# Altium schematic sheet BBB Headers.SchDoc: BBB Headers
size Tabloid; DocumentNumber: LM-003; Revision: C; SheetNumber: 1; SheetTotal: 4
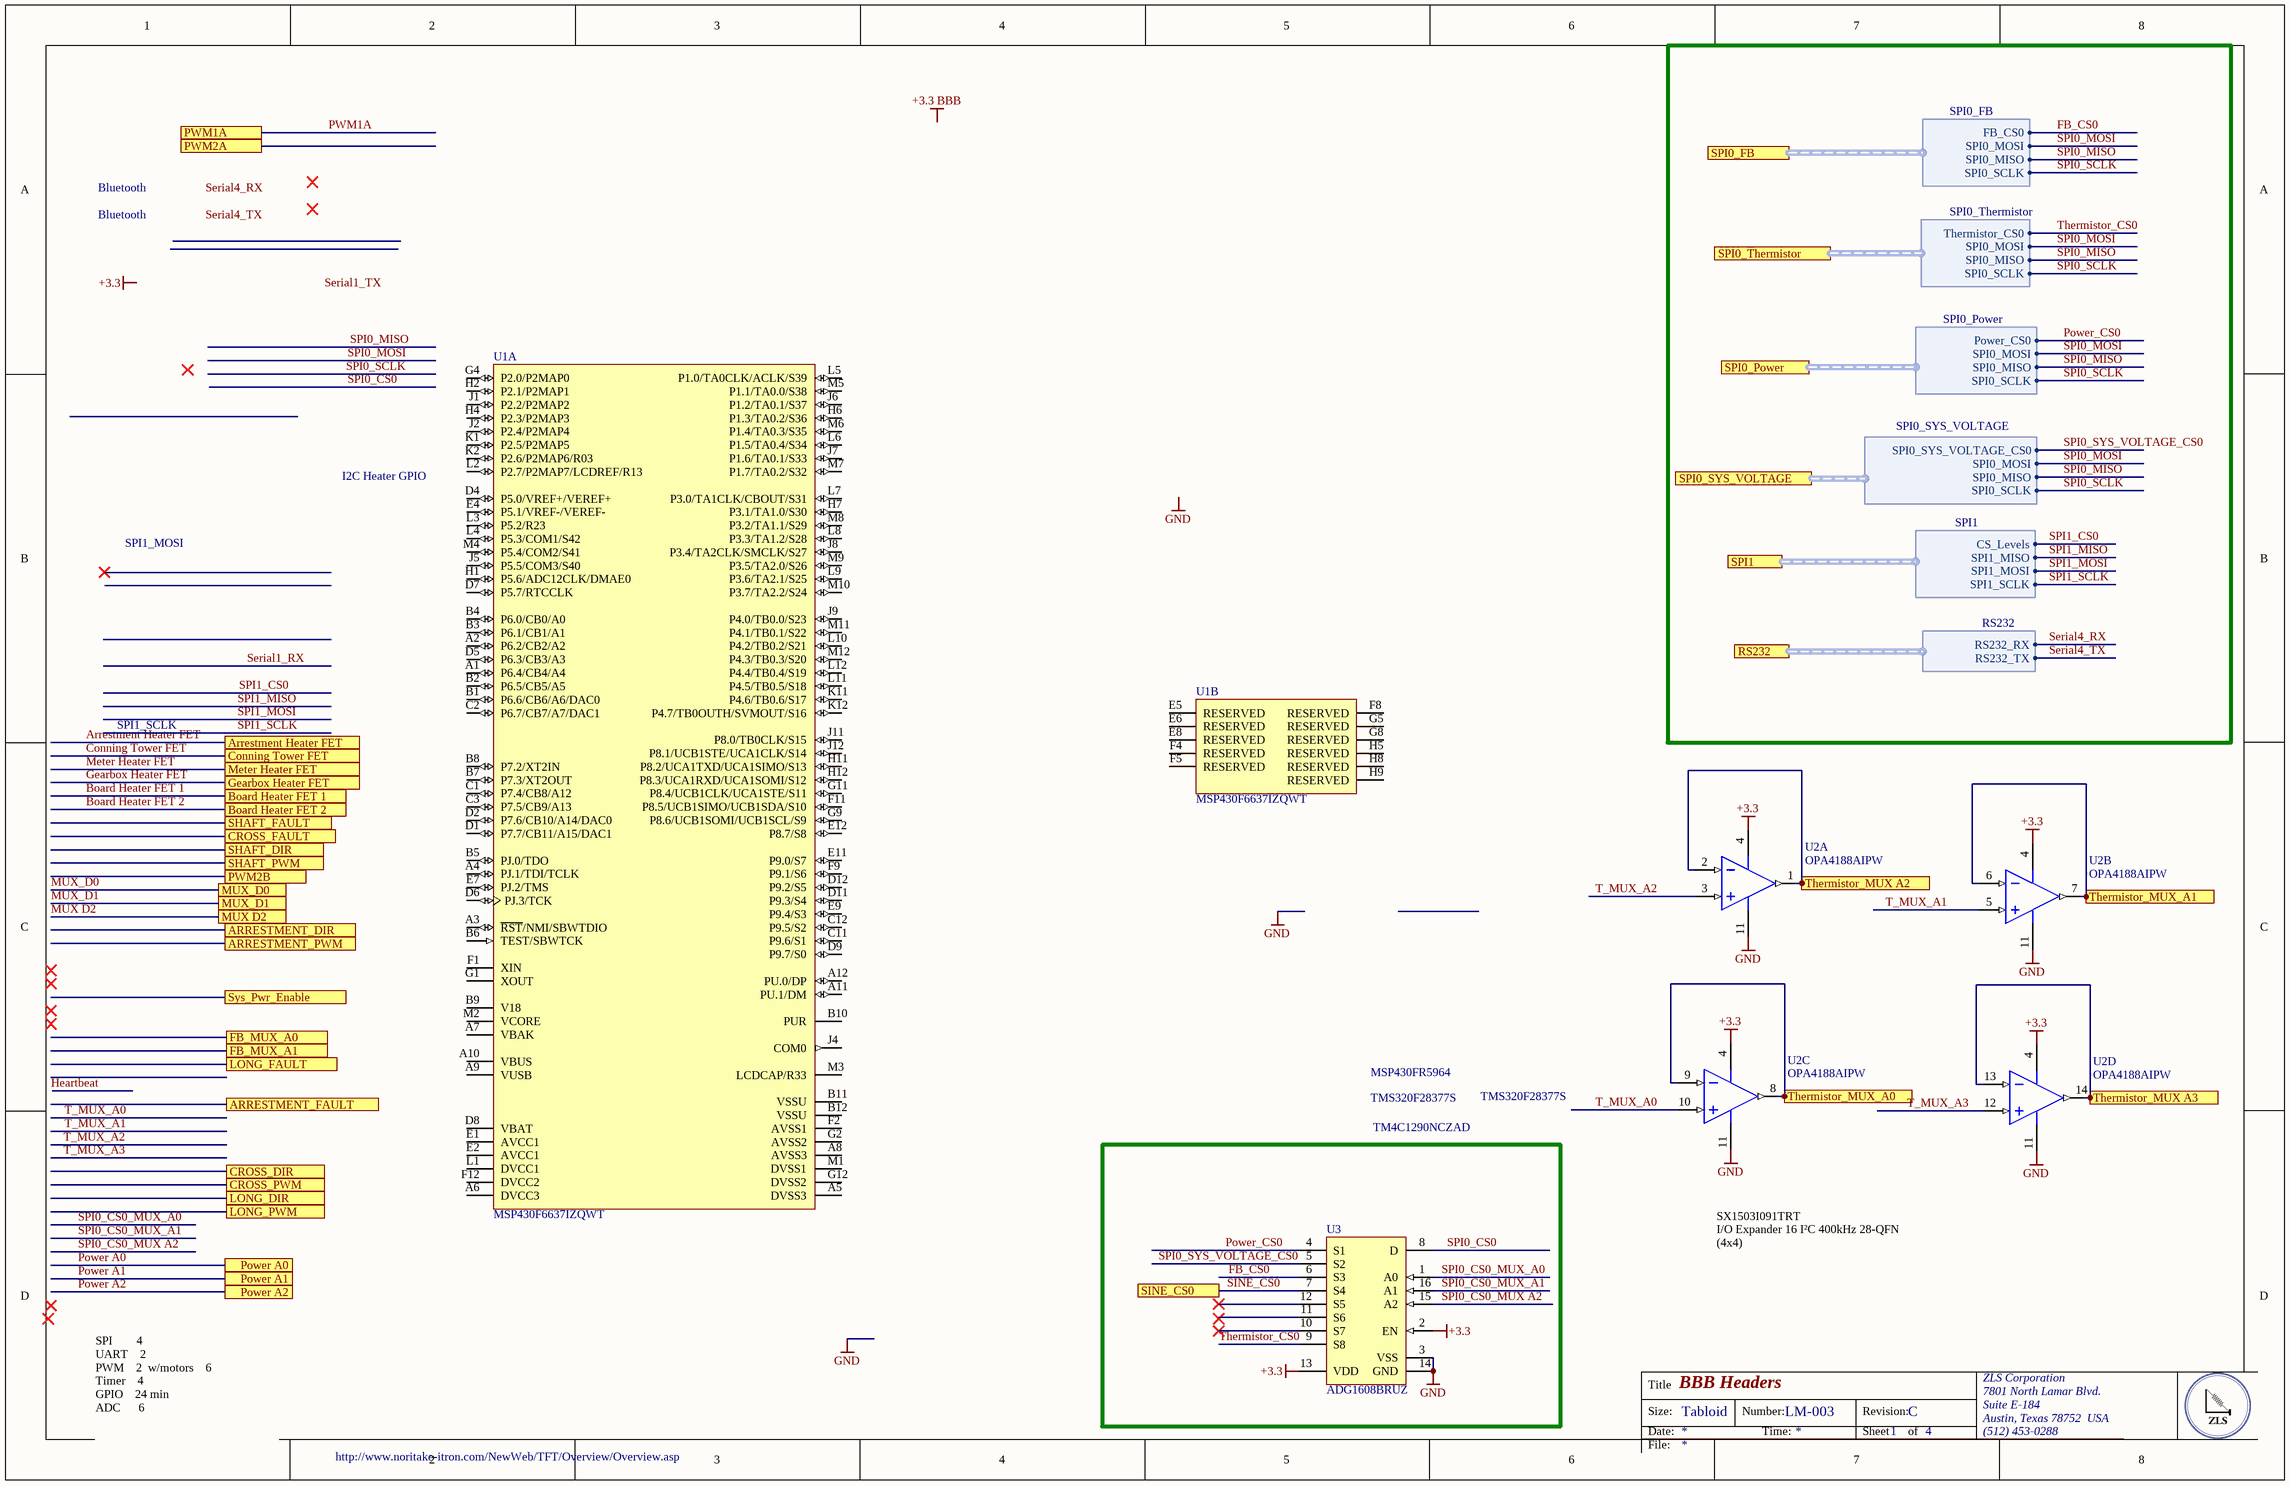
[diagram p0: BBB Headers.SchDoc]

## Parts
U1  MSP430F6637IZQWT  [TI-ZQW113]  (parts A,B of 2)
U2  OPA4188AIPW  [PW0014A_N]  (parts A,B,C,D of 4)
U3  ADG1608BRUZ  [ADI-RU-16_M]

## Blocks framed on the sheet
TM4C1290NCZAD: U3

## Ports
Arrestment Heater FET, ARRESTMENT_DIR, ARRESTMENT_FAULT, ARRESTMENT_PWM, Board Heater FET 1, Board Heater FET 2, Conning Tower FET, CROSS_DIR, CROSS_FAULT, CROSS_PWM, FB_MUX_A0, FB_MUX_A1, Gearbox Heater FET, LONG_DIR, LONG_FAULT, LONG_PWM, Meter Heater FET, MUX D2, MUX_D0, MUX_D1, Power A0, Power A1, Power A2, PWM1A, PWM2A, PWM2B, RS232 (harness RS232), SHAFT_DIR, SHAFT_FAULT, SHAFT_PWM, SINE_CS0, SPI0_FB (harness SPI0_FB), SPI0_Power (harness SPI0_Power), SPI0_SYS_VOLTAGE (harness SPI0_SYS_VOLTAGE), SPI0_Thermistor (harness SPI0_Thermistor), SPI1 (harness SPI1), Sys_Pwr_Enable, Thermistor_MUX A2, Thermistor_MUX A3, Thermistor_MUX_A0, Thermistor_MUX_A1

## Harnesses
RS232: RS232_RX, RS232_TX
SPI1: CS_Levels, SPI1_MISO, SPI1_MOSI, SPI1_SCLK
SPI0_Power: Power_CS0, SPI0_MOSI, SPI0_MISO, SPI0_SCLK
SPI0_Thermistor: Thermistor_CS0, SPI0_MOSI, SPI0_MISO, SPI0_SCLK
SPI0_FB: FB_CS0, SPI0_MOSI, SPI0_MISO, SPI0_SCLK
SPI0_SYS_VOLTAGE: SPI0_SYS_VOLTAGE_CS0, SPI0_MOSI, SPI0_MISO, SPI0_SCLK

## Nets
+3.3: U2.4(V+) U3.2(EN) U3.13(VDD)
GND: U2.11(V-) U3.3(VSS) U3.14(GND)
Arrestment Heater FET: port Arrestment Heater FET
Board Heater FET 1: port Board Heater FET 1
Board Heater FET 2: port Board Heater FET 2
Conning Tower FET: port Conning Tower FET
FB_CS0: U3.6(S3) ; port SPI0_FB.FB_CS0
Gearbox Heater FET: port Gearbox Heater FET
Meter Heater FET: port Meter Heater FET
MUX D2: port MUX D2
MUX_D0: port MUX_D0
MUX_D1: port MUX_D1
Power A0: port Power A0
Power A1: port Power A1
Power A2: port Power A2
Power_CS0: U3.4(S1) ; port SPI0_Power.Power_CS0
PWM1A: port PWM1A
Serial4_RX: port RS232.RS232_RX
Serial4_TX: port RS232.RS232_TX
SINE_CS0: U3.7(S4) ; port SINE_CS0
SPI0_CS0: U3.8(D)
SPI0_CS0_MUX A2: U3.15(A2)
SPI0_CS0_MUX_A0: U3.1(A0)
SPI0_CS0_MUX_A1: U3.16(A1)
SPI0_MISO: port SPI0_Power.SPI0_MISO, port SPI0_Thermistor.SPI0_MISO, port SPI0_FB.SPI0_MISO, port SPI0_SYS_VOLTAGE.SPI0_MISO
SPI0_MOSI: port SPI0_Power.SPI0_MOSI, port SPI0_Thermistor.SPI0_MOSI, port SPI0_FB.SPI0_MOSI, port SPI0_SYS_VOLTAGE.SPI0_MOSI
SPI0_SCLK: port SPI0_Power.SPI0_SCLK, port SPI0_Thermistor.SPI0_SCLK, port SPI0_FB.SPI0_SCLK, port SPI0_SYS_VOLTAGE.SPI0_SCLK
SPI0_SYS_VOLTAGE_CS0: U3.5(S2) ; port SPI0_SYS_VOLTAGE.SPI0_SYS_VOLTAGE_CS0
SPI1_CS0: port SPI1.CS_Levels
SPI1_MISO: port SPI1.SPI1_MISO
SPI1_MOSI: port SPI1.SPI1_MOSI
SPI1_SCLK: port SPI1.SPI1_SCLK
T_MUX_A0: U2.10(IN_C+)
T_MUX_A1: U2.5(IN_B+)
T_MUX_A2: U2.3(IN_A+)
T_MUX_A3: U2.12(IN_D+)
Thermistor_CS0: U3.9(S8) ; port SPI0_Thermistor.Thermistor_CS0
Thermistor_MUX A2: U2.1(OUT_A) U2.2(IN_A-) ; port Thermistor_MUX A2
Thermistor_MUX A3: U2.13(IN_D-) U2.14(OUT_D) ; port Thermistor_MUX A3
Thermistor_MUX_A0: U2.8(OUT_C) U2.9(IN_C-) ; port Thermistor_MUX_A0
Thermistor_MUX_A1: U2.6(IN_B-) U2.7(OUT_B) ; port Thermistor_MUX_A1

Not connected (* = marked no-connect by the designer): U1 A1(P6.4/CB4/A4) A2(P6.2/CB2/A2) A3(~{RST}/NMI/SBWTDIO) A4(PJ.1/TDI/TCLK) A5(DVSS3) A6(DVCC3) A7(VBAK) A8(AVSS3) A9(VUSB) A10(VBUS) A11(PU.1/DM) A12(PU.0/DP) B1(P6.6/CB6/A6/DAC0) B2(P6.5/CB5/A5) B3(P6.1/CB1/A1) B4(P6.0/CB0/A0) B5(PJ.0/TDO) B6(TEST/SBWTCK) B7(P7.3/XT2OUT) B8(P7.2/XT2IN) B9(V18) B10(PUR) B11(VSSU) B12(VSSU) C1(P7.4/CB8/A12) C2(P6.7/CB7/A7/DAC1) C3(P7.5/CB9/A13) C11(P9.6/S1) C12(P9.5/S2) D1(P7.7/CB11/A15/DAC1) D2(P7.6/CB10/A14/DAC0) D4(P5.0/VREF+/VEREF+) D5(P6.3/CB3/A3) D6(PJ.3/TCK) D7(P5.7/RTCCLK) D8(VBAT) D9(P9.7/S0) D11(P9.3/S4) D12(P9.2/S5) E1(AVCC1) E2(AVCC1) E4(P5.1/VREF-/VEREF-) E5(RESERVED) E6(RESERVED) E7(PJ.2/TMS) E8(RESERVED) E9(P9.4/S3) E11(P9.0/S7) E12(P8.7/S8) F1(XIN) F2(AVSS1) F4(RESERVED) F5(RESERVED) F8(RESERVED) F9(P9.1/S6) F11(P8.5/UCB1SIMO/UCB1SDA/S10) F12(DVCC2) G1(XOUT) G2(AVSS2) G4(P2.0/P2MAP0) G5(RESERVED) G8(RESERVED) G9(P8.6/UCB1SOMI/UCB1SCL/S9) G11(P8.4/UCB1CLK/UCA1STE/S11) G12(DVSS2) H1(P5.6/ADC12CLK/DMAE0) H2(P2.1/P2MAP1) H4(P2.3/P2MAP3) H5(RESERVED) H6(P1.3/TA0.2/S36) H7(P3.1/TA1.0/S30) H8(RESERVED) H9(RESERVED) H11(P8.2/UCA1TXD/UCA1SIMO/S13) H12(P8.3/UCA1RXD/UCA1SOMI/S12) J1(P2.2/P2MAP2) J2(P2.4/P2MAP4) J4(COM0) J5(P5.5/COM3/S40) J6(P1.2/TA0.1/S37) J7(P1.6/TA0.1/S33) J8(P3.4/TA2CLK/SMCLK/S27) J9(P4.0/TB0.0/S23) J11(P8.0/TB0CLK/S15) J12(P8.1/UCB1STE/UCA1CLK/S14) K1(P2.5/P2MAP5) K2(P2.6/P2MAP6/R03) K11(P4.6/TB0.6/S17) K12(P4.7/TB0OUTH/SVMOUT/S16) L1(DVCC1) L2(P2.7/P2MAP7/LCDREF/R13) L3(P5.2/R23) L4(P5.3/COM1/S42) L5(P1.0/TA0CLK/ACLK/S39) L6(P1.5/TA0.4/S34) L7(P3.0/TA1CLK/CBOUT/S31) L8(P3.3/TA1.2/S28) L9(P3.6/TA2.1/S25) L10(P4.2/TB0.2/S21) L11(P4.5/TB0.5/S18) L12(P4.4/TB0.4/S19) M1(DVSS1) M2(VCORE) M3(LCDCAP/R33) M4(P5.4/COM2/S41) M5(P1.1/TA0.0/S38) M6(P1.4/TA0.3/S35) M7(P1.7/TA0.2/S32) M8(P3.2/TA1.1/S29) M9(P3.5/TA2.0/S26) M10(P3.7/TA2.2/S24) M11(P4.1/TB0.1/S22) M12(P4.3/TB0.3/S20); U3 10(S7)* 11(S6) 12(S5)*

## Notes on the sheet
- Bluetooth
- I2C Heater GPIO
- SPI1_MOSI
- SPI1_SCLK
- MSP430FR5964
- TMS320F28377S
- SX1503I091TRT
  I/O Expander 16 I²C 400kHz 28-QFN (4x4)
- SPI        4
  UART    2
  PWM    2  w/motors    6
  Timer    4
  GPIO    24 min
  ADC      6
- http://www.noritake-itron.com/NewWeb/TFT/Overview/Overview.asp
- Labels drawn without touching a wire or pin: +3.3, +3.3 BBB, GND, Heartbeat, Serial1_TX, Serial4_RX, Serial4_TX
- Title
- Size:
- Date:
- Tabloid
- Number:
- Time:
- Revision:
- Sheet
- of
- ZLS Corporation
- 7801 North Lamar Blvd.
- Suite E-184
- Austin, Texas 78752  USA
- (512) 453-0288
- File:

## Library data of the parts
U1 = CMP-0365-01413-1: 20 MHz Mixed Signal Microcontroller with 192 KB Flash, 16384 B SRAM and 74 GPIOs, -40 to 85 degC, 113-pin BGA (ZQW), Green (RoHS & no Sb/Br); Manufacturer: Texas Instruments; Frequency(MHz): 20; Brown Out Reset: Yes; Real-Time Clock: Yes, with battery backup; DMA: 3; ADC Channels: 16; Timers - 16-bit: 4; DAC: 2; ADC: 12-bit SAR; SRAM(B): 16384; GPIO: 74; Multiplier: 32x32; Flash(KB): 192; USB: 1; SubFamily: 6 Series with LCD; Eco-Plan: Green (RoHS & no Sb/Br); ComponentLink3URL: http://www.ti.com/lit/ml/mpbg674/mpbg674.pdf; PackageReference: ZQW113; PackageVersion: 4204599-3/D; ComponentLink2Description: Datasheet; Watchdog: Yes; ComponentLink1Description: Manufacturer URL; ComponentLink2URL: http://www.ti.com/general/docs/lit/getliterature.tsp?genericPartNumber=MSP430F6637&fileType=pdf; PartNumber: MSP430F6637IZQWT; Temp Sensor: Yes; Code_JEDEC: MO-225; USCI_B (I2C & SPI): 2; ComponentLink1URL: http://www.ti.com/; SVS: Yes; DatasheetVersion: SLAS566C; ComponentLink3Description: Package Specification; PackageDescription: 113-Pin Plastic Ball Grid Array Package, Body 7 x 7 mm, Pitch 0.5 mm; USCI_A (UART/LIN/IrDA/SPI): 2; Mounting Technology: Surface Mount; Comparators: Yes; PartId: 1
U2 = CMP-0809-00010-2: 0.03 uV/C, Low Noise, Rail-to-Rail Output, Zero-Drift Operational Amplifier, 4 to 36 V, -40 to 125 degC, 14-pin SOP (PW14), Green (RoHS & no Sb/Br); Manufacturer: Texas Instruments; Number of Channels: 4; SubFamily: High Supply Voltage Amplifier (>=30V), Low Noise Amp (<=10nV/rtHz), Low Offset Voltage Amplifier (<=500uV), Low Power Amp (<=500uA), Zero Drift Precision Amplifier; CMRR(Min)(dB): 120; Iq per channel(Max)(mA): 0.475; Offset Drift(Typ)(uV/C): 0.03; Rating: Catalog; GBW(Typ)(MHz): 2; Total Supply Voltage(Max)(+5V is 5, +/-5V is 10): 36; Slew Rate(Typ)(V/us): 0.8; PackageReference: PW0014A; Eco-Plan: Green (RoHS & no Sb/Br); PackageVersion: 4040064-3/G, 02/2011; PartNumber: OPA4188AIPW; Code_JEDEC: MO-153; ComponentLink3URL: http://www.ti.com/litv/pdf/mpds360; ComponentLink1Description: Manufacturer URL; ComponentLink2Description: Datasheet; PackageDescription: 14-Pin Plastic Small Outline, Body 5 x 4.4 mm, Pitch 0.65 mm; Total Supply Voltage(Min)(+5V is 5, +/-5V is 10): 4; ComponentLink1URL: http://www.ti.com/; ComponentLink3Description: Package Specification; DatasheetVersion: SBOS641B; Mounting Technology: Surface Mount; ComponentLink2URL: http://www.ti.com/lit/ds/symlink/opa4188.pdf; PartId: 1
U3 = CMP-0793-00136-1: 4.5 Ohm Ron, 8-Channel +/-5 V,+12 V, +5 V and +3.3 V Multiplexer, 16-pin SOP (RU-16), Tube; Manufacturer: Analog Devices Inc.; Multiplexer/Demultiplexer Circuit: 8:1; On-State Resistance (Max): 4.5 Ohm; Channel-to-Channel Matching (&Delta;Ron): 120 mOhm; Voltage - Supply, Single (V+): 3.3 V ~ 16 V; Voltage - Supply, Dual (V±): ±3.3 V ~ 8 V; Switch Time (Ton, Toff) (Max): 94ns, 93ns; -3db Bandwidth: 40MHz; Charge Injection: 29pC; Channel Capacitance (CS(off), CD(off)): 19pF, 117pF; Current - Leakage (IS(off)) (Max): 100pA; Crosstalk: -64dB @ 1MHz; Supplier 1: Digi-Key; Supplier Part Number 1: ADG1608BRUZ-ND; Manufacturer Part Number: ADG1608BRUZ; RoHS: RoHS Compliant; Category: Integrated Circuits (ICs); Stock 1: 1151; Pricing 1: 1=9.31, 96=8.01552, 192=6.95979, 576=6.0605 (USD); Packaging: Tube; Part Status: Active; Switch Circuit: -; Operating Temperature: -40°C ~ 125°C (TA); Package / Case: 16-TSSOP (0.173", 4.40mm Width); Supplier Device Package: 16-TSSOP; Base Part Number: ADG1608; ComponentLink1URL: http://www.analog.com/media/en/technical-documentation/data-sheets/ADG1608_1609.pdf; ComponentLink1Description: http://www.analog.com/media/en/technical-documentation/data-sheets/ADG1608_1609.pdf